# EAGLE design 1 Motor (EAGLE 9.6.2)
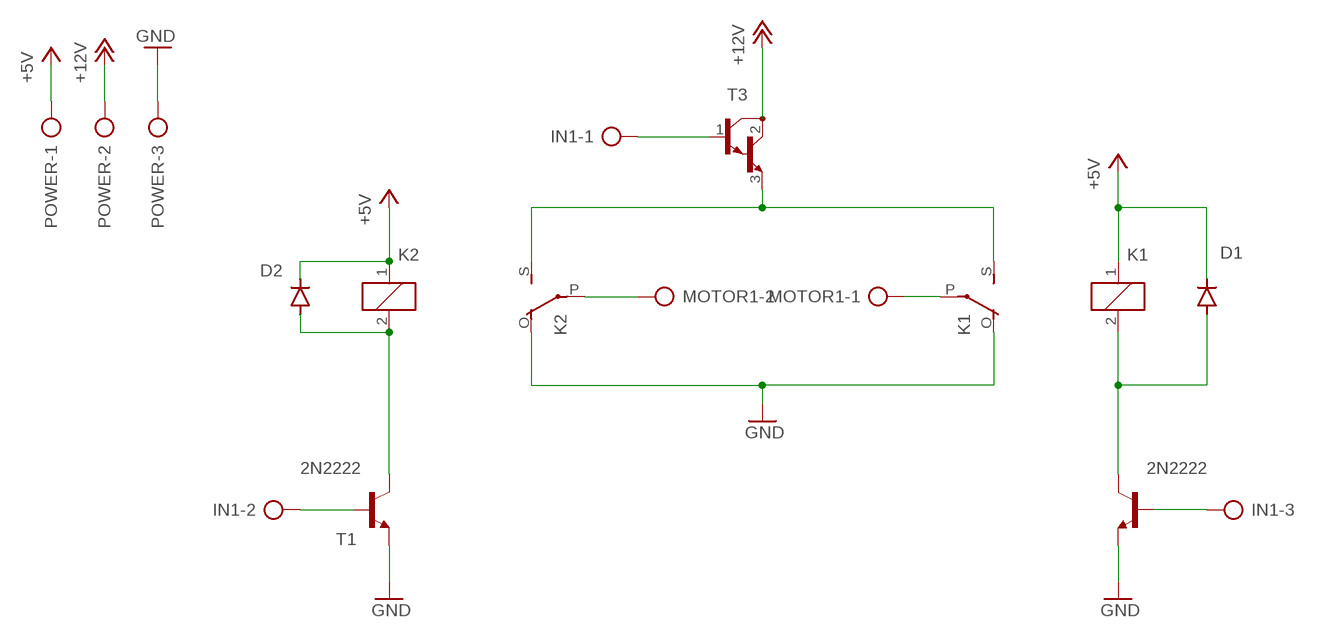
[diagram p0: schematic, sheet 1]

## Parts
D1  1N4004  [DO41-10]
D2  1N4004  [DO41-10]
IN1  AK300/3  [AK300/3]
K1  ZF112  [ZF112]
K2  ZF112  [ZF112]
MOTOR1  AK300/2  [AK300/2]
POWER  AK300/3  [AK300/3]
T1  2N2222  2N2222-NPN-TO92-EBC  [TO92-EBC]
T2  2N2222  2N2222-NPN-TO92-EBC  [TO92-EBC]
T3  TIP122  [TO220]

## Nets
+5V: D1.C D2.C K1.1 K2.1 POWER.1
+12V: POWER.2 T3.2(C)
EN: IN1.1 T3.1(B)
GND: K1.O(2:O) K2.O(2:O) POWER.3 T1.E T2.E
IN1: IN1.2 T1.B
IN2: IN1.3 T2.B
N$1: K2.P(2:P) MOTOR1.2
N$4: D1.A K1.2 T2.C
N$5: K1.P(2:P) MOTOR1.1
N$6: D2.A K2.2 T1.C
NO: K1.S(2:S) K2.S(2:S) T3.3(E)

## Library data of the parts
D1 D2 = diode:1N4004: DIODE general purpose rectifier, 1 A
IN1 POWER = con-ptr500:AK300/3: CONNECTOR; OC_FARNELL: unknown; OC_NEWARK: unknown
K1 K2 = relay:ZF112: RELAY 1 x switch; OC_FARNELL: unknown; OC_NEWARK: unknown
MOTOR1 = con-ptr500:AK300/2: CONNECTOR; OC_FARNELL: unknown; OC_NEWARK: unknown
T1 T2 = transistor-neu-to92:*-NPN-: NPN Transistror
T3 = transistor:TIP122: NPN BIPOLAR DARLINGTON TRANSISTOR

## Board
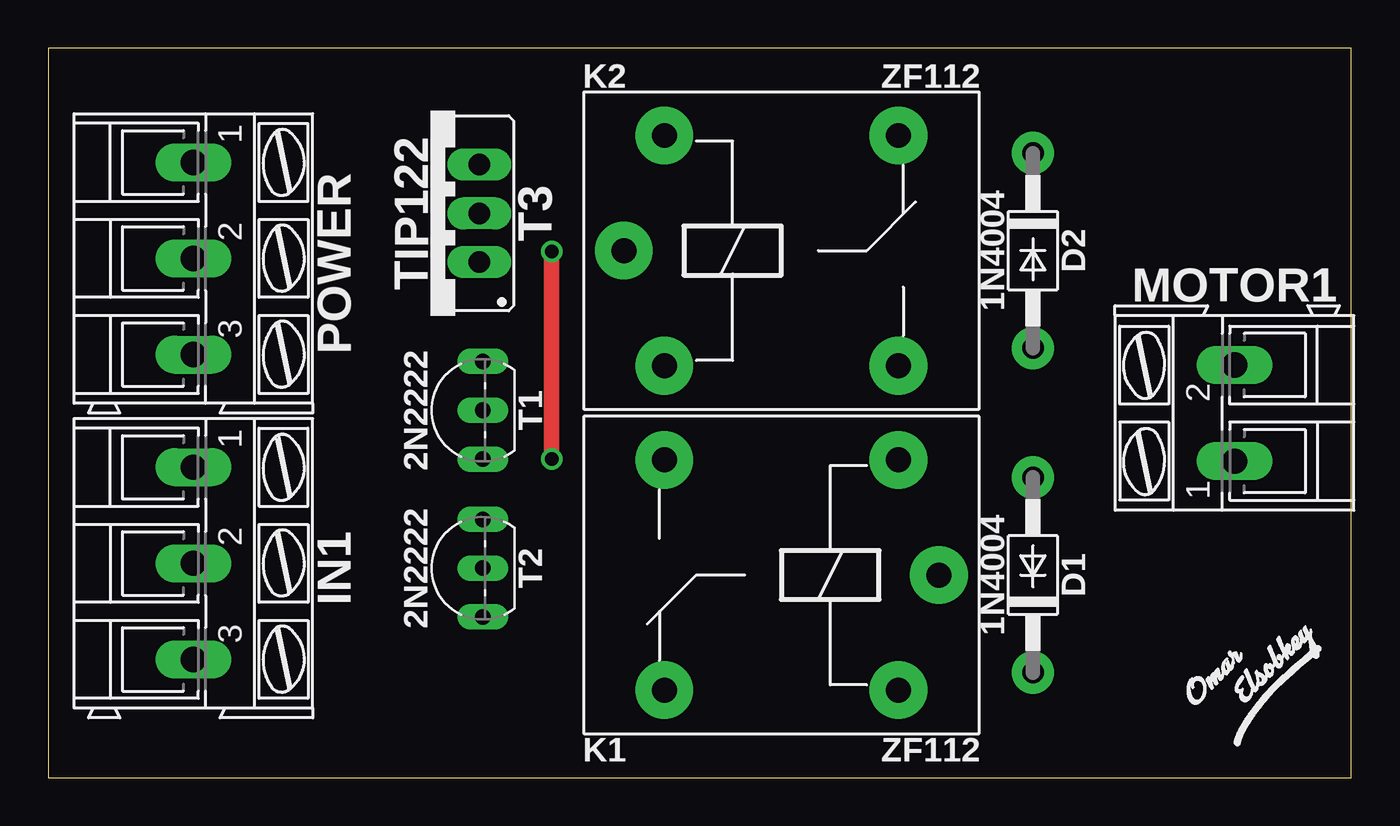
[diagram p1: board, top side]
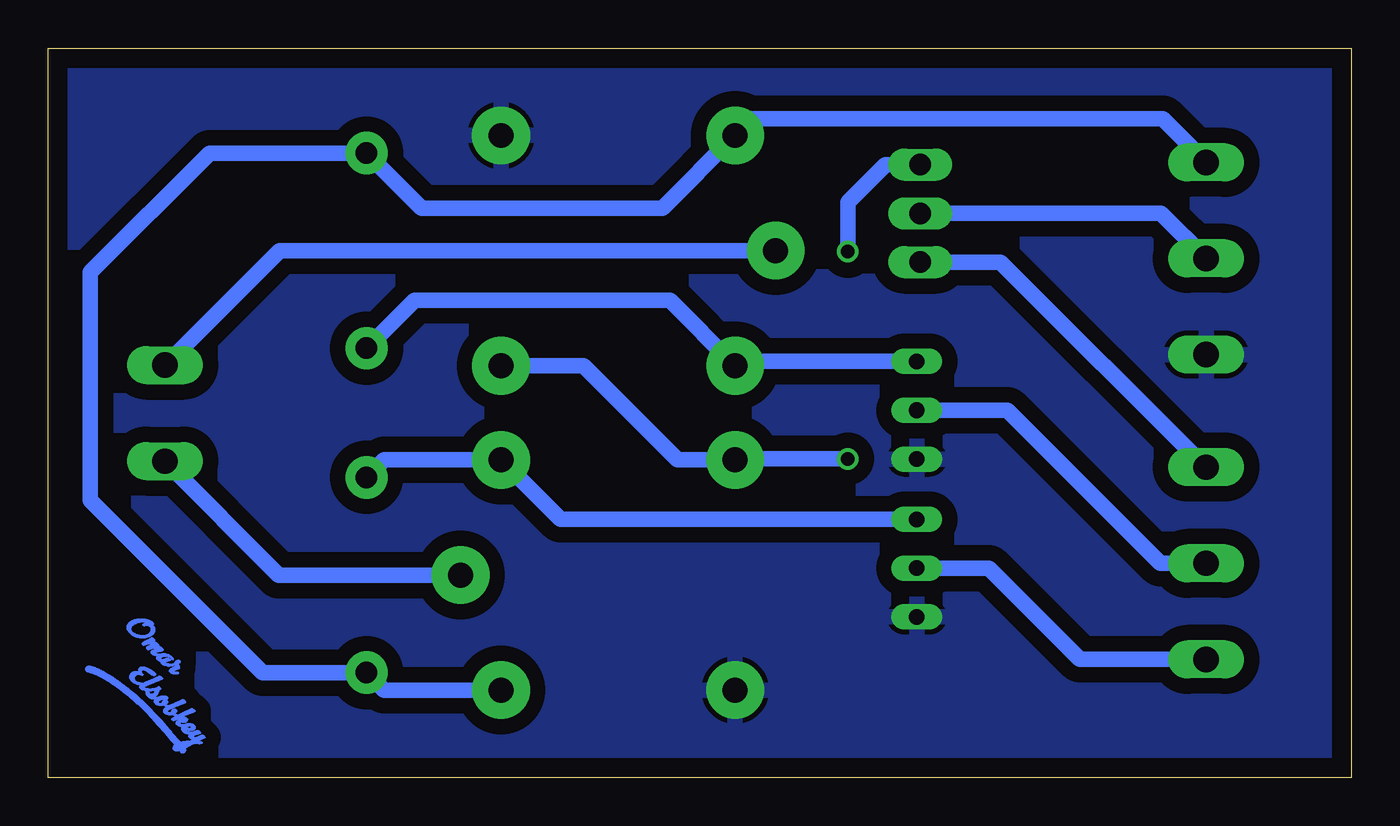
[diagram p2: board, bottom side, seen from below]

Size 67.9 x 38 mm. Coordinates in mm from the lower left corner, seen from the top.
Outline: 67.9,0 67.9,38 0,38 0,0 67.9,0
Copper layers (1*16): Top 0.035mm / dielectric 1.5mm / Bottom 0.035mm
Design rules "default *": minimum track width 0.8mm, minimum drill 0.7mm, track to track 0.6mm, track to pad 0.6mm, pad to pad 0.6mm, via to via 0.6mm, smd to smd 0.6mm, copper to edge 40mil, drill to drill 6mil, minimum pad ring 10mil, minimum via ring 8mil, stop-mask expansion 4mil, vias tented up to drill 0mil, thermal gap 10mil

### Footprints (pad centres in the part's own frame; a part is rotated, then mirrored left to right if it is on the bottom)
DO41-10 = drill 1.118 pad 2.2: A 5.08,0; C -5.08,0
AK300/3 = drill 1.321 long: 1 -5.004,0; 2 0,0; 3 5.004,0
ZF112 = drill 1.3 pad 3: 1 -6.096,5.994; 2 -6.096,-5.994; O 6.096,5.994; P -8.204,0; S 6.096,-5.994
AK300/2 = drill 1.321 long: 1 -2.515,0; 2 2.489,0
TO92-EBC = drill 0.813 long: B 0,-1.27; C 2.54,-1.27; E -2.54,-1.27
TO220 = drill 1.118 long: 1 -2.54,0; 2 0,0; 3 2.54,0

### Placement (x,y rotation side)
D1  51.3,10.56 90 top
D2  51.3,27.45 270 top
IN1  7.57,11.17 270 top
K1  38.2,10.56 180 top
K2  38.2,27.45 0 top
MOTOR1  61.8,19 90 top
POWER  7.57,27.04 270 top
T1  21.37,19.14 90 top
T2  21.37,10.92 90 top
T3  22.47,29.39 90 top
U$1  [OMAR_ELSOBKEY_X0.5_T]  62.41,4.79 315 bottom
U$2  [OMAR_ELSOBKEY_X0.5_TN]  62.81,5.19 45 top

### Tracks (layer width: path | path; a pad name or v marks a point on that pad's centre or on a via)
+5V
  Bottom 0.813: POWER.1 9.83,34.31 31.24,34.31 K2.1 35.89,29.66 48.43,29.66 D2.C 59.49,32.53 65.68,26.33 65.68,14.45 56.72,5.48 D1.C 50.39,4.57 K1.1
+12V
  Bottom 0.813: T3.2 9.92,29.39 POWER.2
EN
  Bottom 0.813: IN1.1 7.59,16.17 18.27,26.85 T3.1
GND
  pour Bottom (isolate 0.8): -1.85,39.64 71.15,39.64 71.15,-2.8 -1.85,-2.8
IN1
  Bottom 0.813: T1.B 17.93,19.14 9.96,11.17 IN1.2
IN2
  Bottom 0.813: T2.B 18.9,10.92 14.15,6.17 IN1.3
N$1
  Bottom 0.813: MOTOR1.2 55.84,27.45 K2.P
N$4
  Bottom 0.813: T2.C 41.2,13.46 K1.2 50.39,16.55 D1.A
N$5
  Bottom 0.813: MOTOR1.1 55.87,10.56 K1.P
N$6
  Bottom 0.813: T1.C 31.88,21.68 K2.2 35.51,24.86 48.81,24.86 D2.A
NO  (via drill 0.7)
  Top 0.813: v26.24,16.61 v26.24,27.4
  Bottom 0.813: K2.S 40.01,21.46 35.1,16.55 K1.S 32.05,16.61 v26.24,16.61 | v26.24,27.4 26.24,29.98 24.28,31.93 T3.3